# Altium schematic sheet Usb.SchDoc
size A4
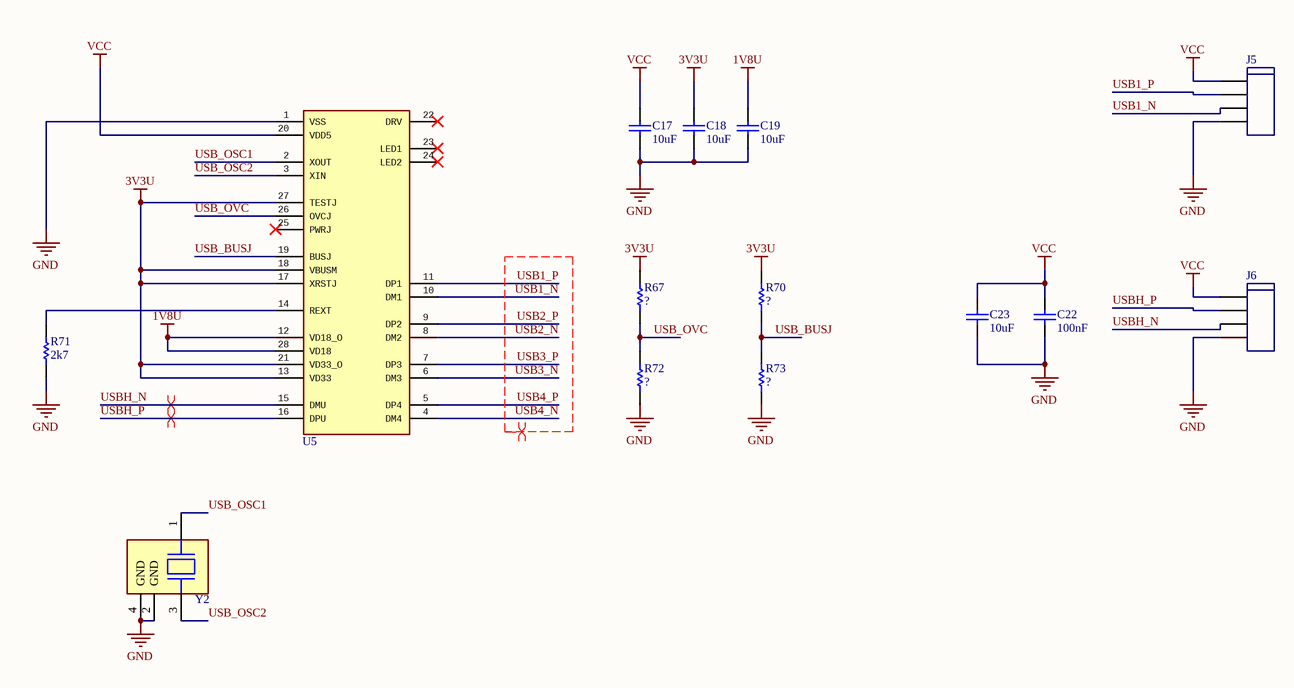
[diagram p0: Usb.SchDoc]

## Parts
C17  10uF  [0603]
C18  10uF  [0603]
C19  10uF  [0603]
C22  100nF  [0603]
C23  10uF  [0603]
J5  JST 4 PIN 1.25mm SMD_1  [JST 4 Pin 1.25mm]  (value not drawn)
J6  JST 4 PIN 1.25mm SMD_1  [JST 4 Pin 1.25mm]  (value not drawn)
R67  RESISTOR GENERIC  [0603]  (value not drawn)
R70  RESISTOR GENERIC  [0603]  (value not drawn)
R71  value 2k7  [0603]  (hidden comment: RESISTOR GENERIC)
R72  RESISTOR GENERIC  [0603]  (value not drawn)
R73  RESISTOR GENERIC  [0603]  (value not drawn)
U5  FE1.1S USB 2.0 hub IC  [FE1.1S_SSOP-28]  (value not drawn)
Y2  XTAL S3212000121080 12MHz 30PPM  [SMD3225-4P]  (value not drawn)

## Nets
1V8U: C19.2 U5.12(VD18_O) U5.28(VD18)
3V3U: C18.2 R67.2 R70.2 U5.13(VD33) U5.17(XRSTJ) U5.18(VBUSM) U5.21(VD33_O) U5.27(TESTJ)
GND: C17.1 C18.1 C19.1 C22.1 C23.1 J5.4 J6.4 R71.1 R72.1 R73.1 U5.1(VSS) Y2.2(GND) Y2.4(GND)
VCC: C17.2 C22.2 C23.2 J5.1 J6.1 U5.20(VDD5)
USB1_N: J5.3 U5.10(DM1)
USB1_P: J5.2 U5.11(DP1)
USB2_N: U5.8(DM2)
USB2_P: U5.9(DP2)
USB3_N: U5.6(DM3)
USB3_P: U5.7(DP3)
USB4_N: U5.4(DM4)
USB4_P: U5.5(DP4)
USB_BUSJ: R70.1 R73.2 U5.19(BUSJ)
USB_OSC1: U5.2(XOUT) Y2.1
USB_OSC2: U5.3(XIN) Y2.3
USB_OVC: R67.1 R72.2 U5.26(OVCJ)
USBH_N: J6.3 U5.15(DMU)
USBH_P: J6.2 U5.16(DPU)
NetR71_2: R71.2 U5.14(REXT)

Not connected (* = marked no-connect by the designer): U5 22(DRV)* 23(LED1)* 24(LED2)* 25(PWRJ)*

## Layout directives
differential pair: USB1_N, USB1_P, USB2_N, USB2_P, USB3_N, USB3_P, USB4_N, USB4_P, USBH_N, USBH_P

## Library data of the parts
C17-C19 C23 = CAP 10uF 20% 0603: Supplier 1: Digi-Key; Supplier 2: Digi-Key; Supplier Part Number 1: 1276-1119-1-ND; Supplier Part Number 2: 445-4112-6-ND
C22 = CAP 100nF 10V 10% 0603: Supplier 1: Digi-Key; Supplier Part Number 1: 399-1095-1-ND
U5 = FE1.1S
Y2 = XTAL S3212000121080 12MHz 30PPM: Crystals 12MHz 10pF 30PPM -40 +85C; Manufacturer: JGHC; LCSC Part: C479193; Part number: S3212000121080
J5 J6 = JST 4 PIN 1.25mm SMD_1: Supplier 1: LCSC; Supplier Part Number 1: C668615
R67 R70-R73 = RESISTOR GENERIC
  R67 R70 R72 R73: Value: ?